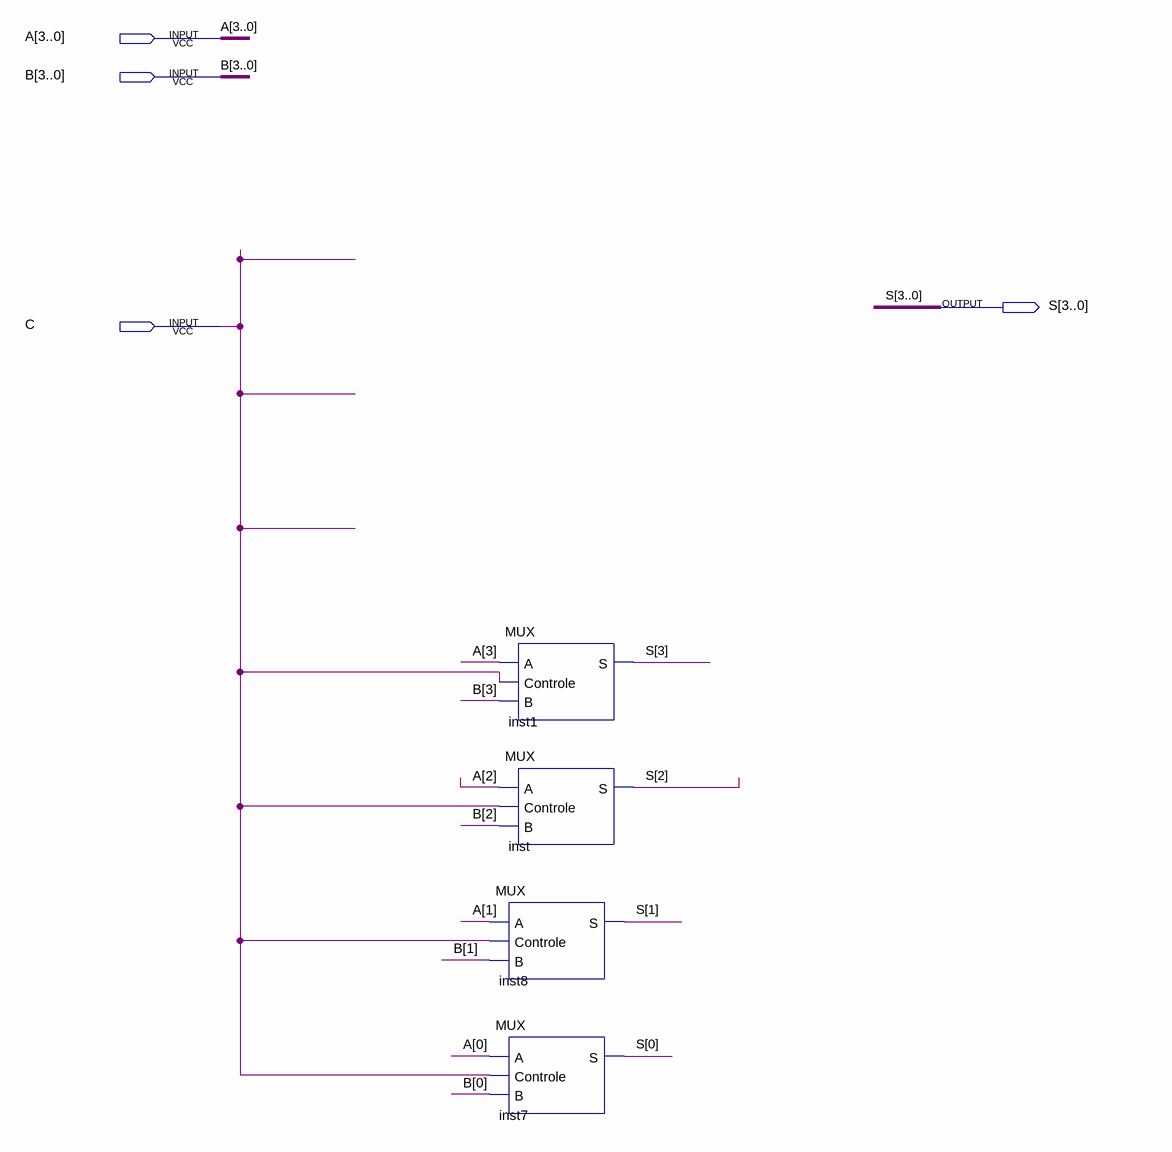
[diagram p0: schematic sheet]
// Quartus schematic MUX4BIT.bdf as structural Verilog: 4 symbols, 4 pins
module MUX4BIT (
  input  [3:0] A,
  input  [3:0] B,
  input  C,
  output [3:0] S
);

  MUX inst1 (.A(A[3]), .Controle(C), .B(B[3]), .S(S[3]));
  MUX inst (.A(A[2]), .Controle(C), .B(B[2]), .S(S[2]));
  MUX inst8 (.A(A[1]), .Controle(C), .B(B[1]), .S(S[1]));
  MUX inst7 (.A(A[0]), .Controle(C), .B(B[0]), .S(S[0]));
endmodule
